# EAGLE schematic MURMERDUINO CAM MOUNTER (EAGLE 6.3)
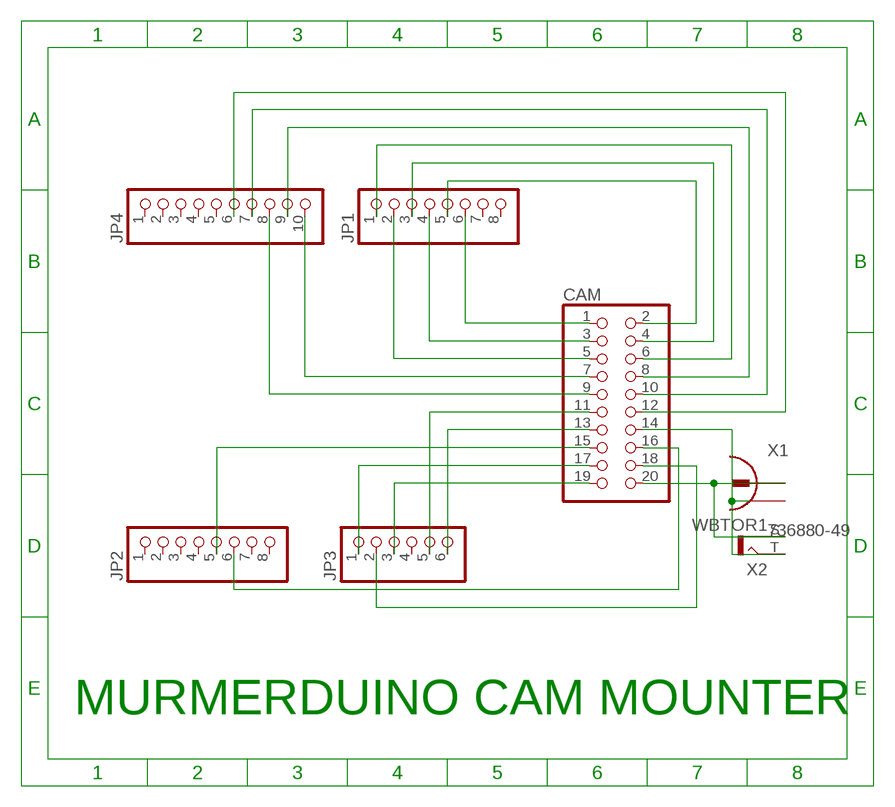
[diagram p0: schematic, sheet 1]

## Parts
CAM  PINHD-2X10  [2X10]
JP1  PINHD-1X8  [1X08]
JP2  PINHD-1X8  [1X08]
JP3  PINHD-1X6  [1X06]
JP4  PINHD-1X10  [1X10]
X1  736880-49  [736880-49]
X2  WBTOR1  [WBTOR1]

## Nets
N$1: CAM.1 JP1.6
N$2: CAM.2 JP1.5
N$3: CAM.3 JP1.4
N$4: CAM.4 JP1.3
N$5: CAM.5 JP1.2
N$6: CAM.6 JP1.1
N$7: CAM.7 JP4.10
N$8: CAM.8 JP4.9
N$9: CAM.9 JP4.8
N$10: CAM.10 JP4.7
N$11: CAM.11 JP3.5
N$12: CAM.13 JP3.6
N$13: CAM.15 JP2.5
N$14: CAM.16 JP2.6
N$15: CAM.12 JP4.6
N$16: CAM.17 JP3.1
N$17: CAM.18 JP3.2
N$18: CAM.19 JP3.3
N$19: CAM.20 X1.1 X2.S
N$20: CAM.14 X2.T
Unconnected: JP1.7 JP1.8 JP2.1 JP2.2 JP2.3 JP2.4 JP2.7 JP2.8 JP3.4 JP4.1 JP4.2 JP4.3 JP4.4 JP4.5 X1.2 X1.2@2

## Notes on the sheet
- MURMERDUINO CAM MOUNTER

## Library data of the parts
CAM = pinhead:PINHD-2X10: PIN HEADER
JP1 JP2 = pinhead:PINHD-1X8: PIN HEADER
JP3 = pinhead:PINHD-1X6: PIN HEADER
JP4 = pinhead:PINHD-1X10: PIN HEADER
X1 = con-conrad:736880-49: Cinch Connector ( RCA Jack )
X2 = con-lumberg:WBTOR1: RCA connectors according to JEITA RC-5231 Cinch RCA-Einbaukupplung nach JEITA RC-5231, abgewinkelte Ausführung Source: http://www.lumberg.de/Produkte/PDFs/WBTOR1.pdf; MPN: WBTOR 1 BLACK; OC_FARNELL: 1200146; OC_NEWARK: 98K2588